# EAGLE design untitled (EAGLE 5.00)
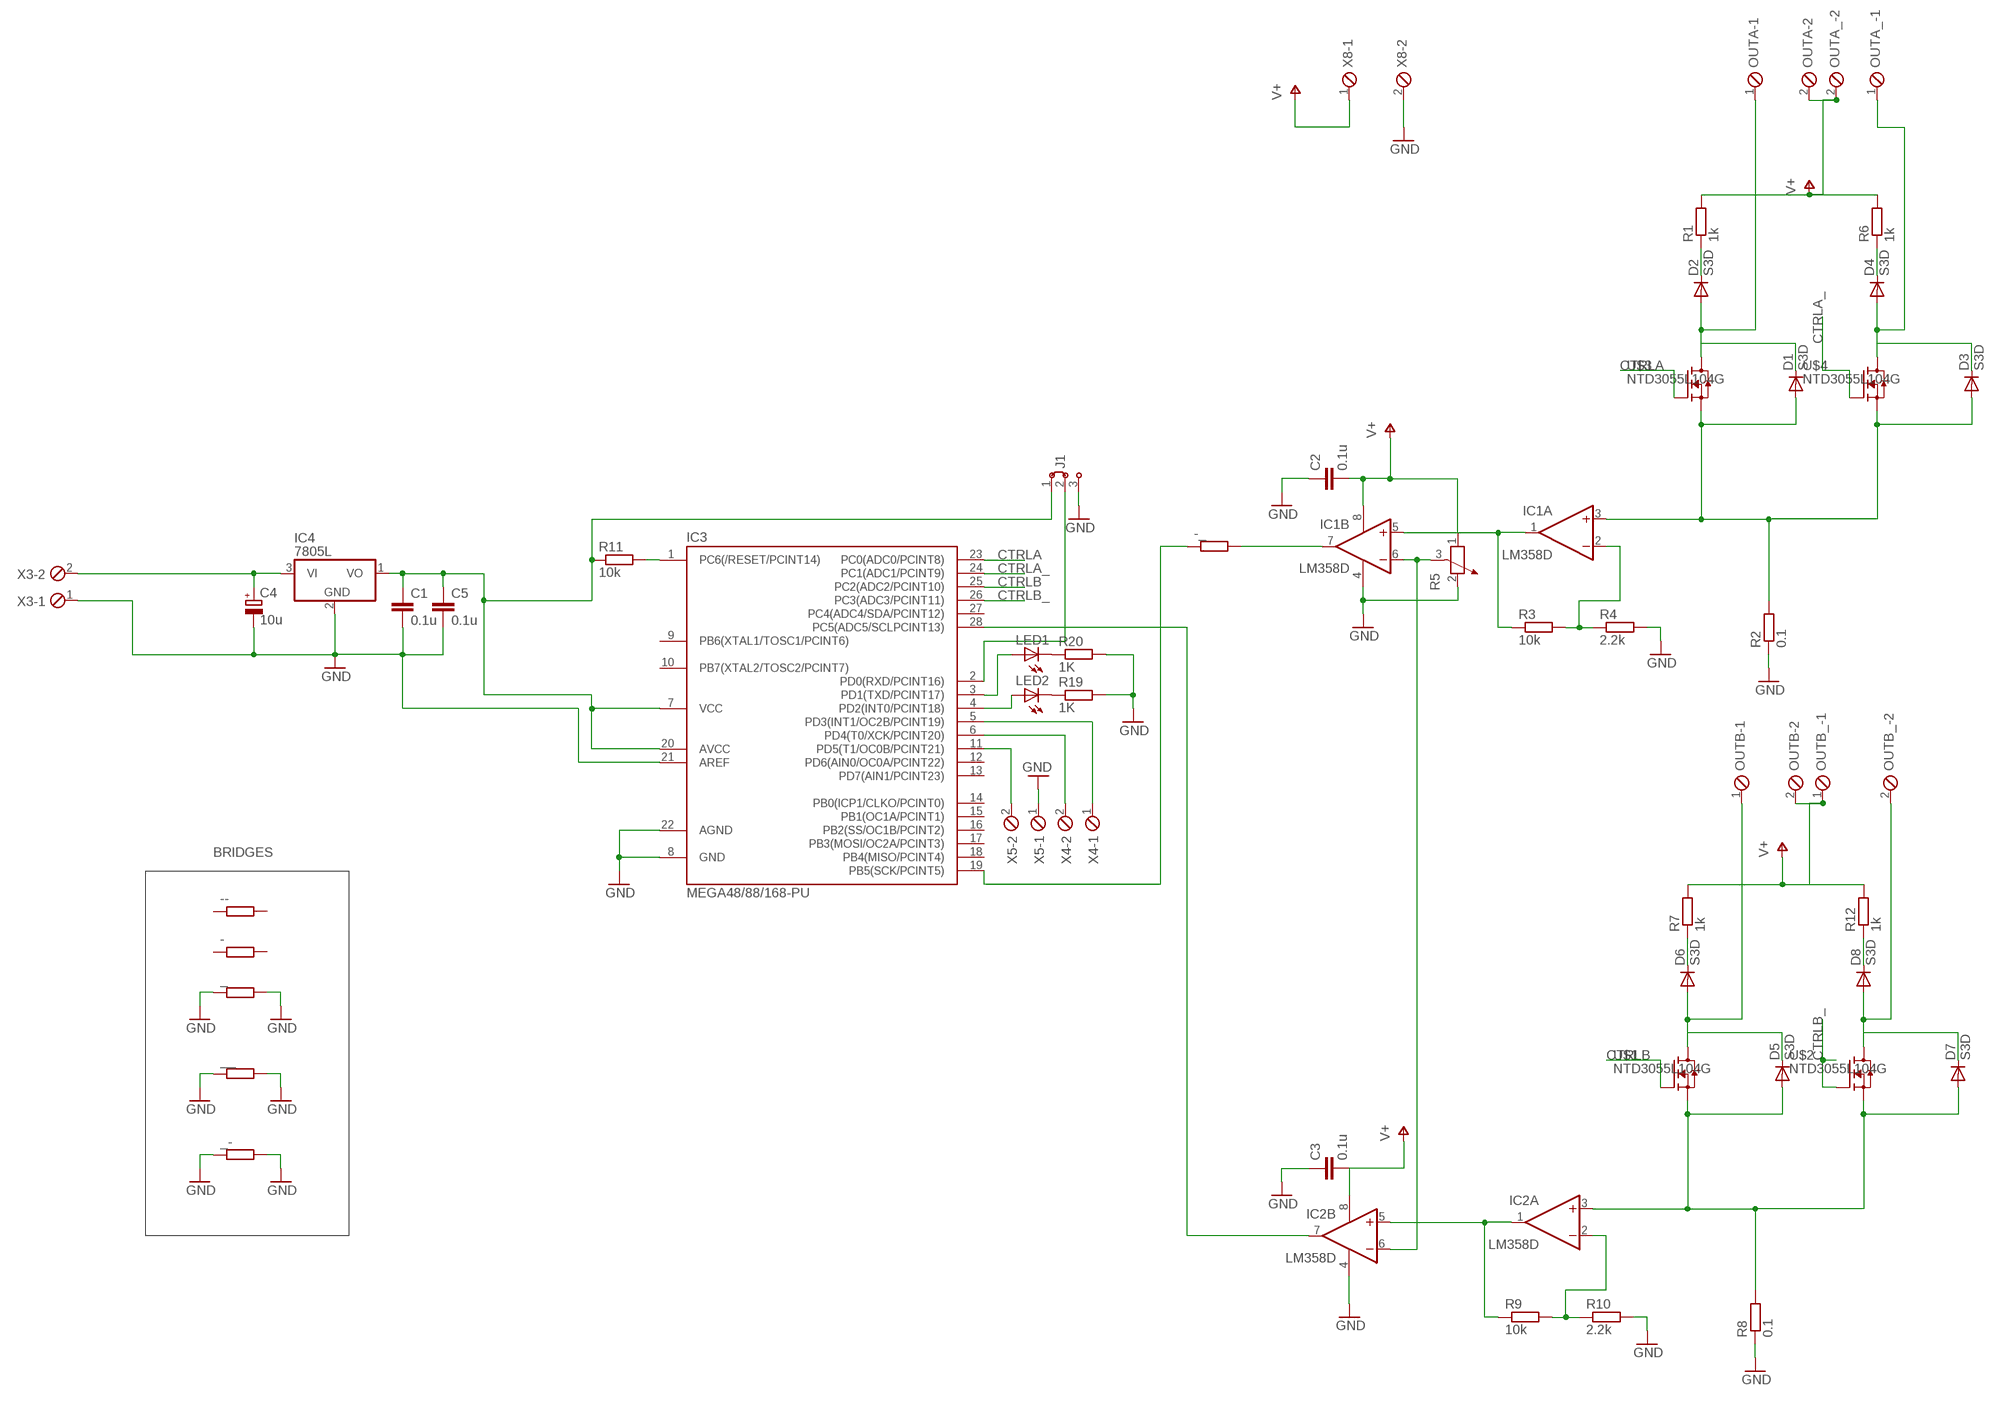
[diagram p0: schematic, sheet 1]

## Parts
-  R-EU_R1206  [R1206]
--  R-EU_R1206  [R1206]
-_  R-EU_R1206  [R1206]
_  R-EU_R1206  [R1206]
_-  R-EU_R1206  [R1206]
__  R-EU_R1206  [R1206]
C1  0.1u  C-EUC1206  [C1206]
C2  0.1u  C-EUC1206  [C1206]
C3  0.1u  C-EUC1206  [C1206]
C4  10u  CPOL-EUE3.5-8  [E3,5-8]
C5  0.1u  C-EUC1206  [C1206]
D1  S3D  DIODE-SMC  [SMC]
D2  S3D  DIODE-SMC  [SMC]
D3  S3D  DIODE-SMC  [SMC]
D4  S3D  DIODE-SMC  [SMC]
D5  S3D  DIODE-SMC  [SMC]
D6  S3D  DIODE-SMC  [SMC]
D7  S3D  DIODE-SMC  [SMC]
D8  S3D  DIODE-SMC  [SMC]
IC1  LM358D  [SO08]
IC2  LM358D  [SO08]
IC3  MEGA48/88/168-PU  [DIL28-3]
IC4  7805L  [TO92]
J1  J2X2MM  [04C]
LED1  LED5MM  [LED5MM]
LED2  LED5MM  [LED5MM]
OUTA  MPT2  [2POL254]
OUTA_  MPT2  [2POL254]
OUTB  MPT2  [2POL254]
OUTB_  MPT2  [2POL254]
R1  1k  R-EU_0207/10  [0207/10]
R2  0.1  R-EU_0617/22  [0617/22]
R3  10k  R-EU_R0805  [R0805]
R4  2.2k  R-EU_R0805  [R0805]
R5  POTENTIOMETER_PT-10  [PT-10]
R6  1k  R-EU_0207/10  [0207/10]
R7  1k  R-EU_0207/10  [0207/10]
R8  0.1  R-EU_0617/22  [0617/22]
R9  10k  R-EU_R0805  [R0805]
R10  2.2k  R-EU_R0805  [R0805]
R11  10k  R-EU_R0805  [R0805]
R12  1k  R-EU_0207/10  [0207/10]
R19  1K  R-EU_R0805  [R0805]
R20  1K  R-EU_R0805  [R0805]
U$1  NTD3055L104G  [TO252]
U$2  NTD3055L104G  [TO252]
U$3  NTD3055L104G  [TO252]
U$4  NTD3055L104G  [TO252]
X3  MPT2  [2POL254]
X4  MPT2  [2POL254]
X5  MPT2  [2POL254]
X8  MPT2  [2POL254]

## Nets
CTRLA: IC3.23(PC0(ADC0/PCINT8)) U$3.1(G)
CTRLA_: IC3.24(PC1(ADC1/PCINT9)) U$4.1(G)
CTRLB: IC3.25(PC2(ADC2/PCINT10)) U$1.1(G)
CTRLB_: IC3.26(PC3(ADC3/PCINT11)) U$2.1(G)
GND: _-.1 _-.2 _.1 _.2 __.1 __.2 C1.2 C2.1 C3.1 C4.- C5.2 IC1.4(P:V-) IC2.4(P:V-) IC3.8(GND) IC3.21(AREF) IC3.22(AGND) IC4.2(GND) J1.3 R2.1 R4.2 R5.2 R8.1 R10.2 R19.2 R20.2 X3.1 X5.1 X8.2
N$1: IC1.1(A:OUT) IC1.5(B:+IN) R3.1
N$2: IC1.2(A:-IN) R3.2 R4.1
N$3: -_.1 IC3.19(PB5(SCK/PCINT5))
N$4: IC2.7(B:OUT) IC3.28(PC5(ADC5/SCLPCINT13))
N$5: IC3.11(PD5(T1/OC0B/PCINT21)) X5.2
N$6: IC1.6(B:-IN) IC2.6(B:-IN) R5.3
N$7: D1.C D2.A OUTA.1 U$3.3(D)
N$8: D2.C R1.1
N$9: C4.+ IC4.3(VI) X3.2
N$10: D3.C D4.A OUTA_.1 U$4.3(D)
N$11: D4.C R6.1
N$12: D1.A D3.A IC1.3(A:+IN) R2.2 U$3.2(S) U$4.2(S)
N$13: -_.2 IC1.7(B:OUT)
N$14: IC3.1(PC6(/RESET/PCINT14)) R11.2
N$15: IC3.6(PD4(T0/XCK/PCINT20)) X4.2
N$16: IC2.1(A:OUT) IC2.5(B:+IN) R9.1
N$17: IC2.2(A:-IN) R9.2 R10.1
N$18: LED2.K(C) R19.1
N$19: C1.1 C5.1 IC3.7(VCC) IC3.20(AVCC) IC4.1(VO) J1.1 R11.1
N$20: D5.C D6.A OUTB.1 U$1.3(D)
N$21: D6.C R7.1
N$22: D7.C D8.A OUTB_.2 U$2.3(D)
N$23: D8.C R12.1
N$24: D5.A D7.A IC2.3(A:+IN) R8.2 U$1.2(S) U$2.2(S)
N$25: LED1.K(C) R20.1
N$26: IC3.5(PD3(INT1/OC2B/PCINT19)) X4.1
N$27: IC3.4(PD2(INT0/PCINT18)) LED2.A
N$28: IC3.3(PD1(TXD/PCINT17)) LED1.A
N$29: IC3.2(PD0(RXD/PCINT16)) J1.2
V+: C2.2 C3.2 IC1.8(P:V+) IC2.8(P:V+) OUTA.2 OUTA_.2 OUTB.2 OUTB_.1 R1.2 R5.1 R6.2 R7.2 R12.2 X8.1
Unconnected: --.1 --.2 -.1 -.2 IC3.9(PB6(XTAL1/TOSC1/PCINT6)) IC3.10(PB7(XTAL2/TOSC2/PCINT7)) IC3.12(PD6(AIN0/OC0A/PCINT22)) IC3.13(PD7(AIN1/PCINT23)) IC3.14(PB0(ICP1/CLKO/PCINT0)) IC3.15(PB1(OC1A/PCINT1)) IC3.16(PB2(SS/OC1B/PCINT2)) IC3.17(PB3(MOSI/OC2A/PCINT3)) IC3.18(PB4(MISO/PCINT4)) IC3.27(PC4(ADC4/SDA/PCINT12))

## Notes on the sheet
- BRIDGES

## Library data of the parts
- -- -_ _ _- __ R3 R4 R9-R11 R19 R20 = rcl:R-EU_: RESISTOR, European symbol
C1-C3 C5 = rcl:C-EU: CAPACITOR, European symbol
C4 = rcl:CPOL-EU: POLARIZED CAPACITOR, European symbol
D1-D8 = diode:DIODE-: DIODE
IC1 IC2 = linear:LM358: OP AMP also LM158; LM258; LM2904 Source: http://cache.national.com/ds/LM/LM158.pdf
IC3 = avr-4:MEGA48/88/168-PU
IC4 = linear:78*: Positive VOLTAGE REGULATOR Source: http://cache.national.com/ds/LM/LM78L05.pdf http://www.fairchildsemi.com/ds/LM/LM7805.pdf
J1 = jumper:J2: Jumper switch 2 x 2.5 mm
LED1 LED2 = led:LED: LED OSRAM: - CHIPLED LG R971, LG N971, LY N971, LG Q971, LY Q971, LO R971, LY R971 LH N974, LH R974 LS Q976, LO Q976, LY Q976 LO Q996 - Hyper CHIPLED LW Q18S LB Q993, LB Q99A, LB R99A - SideLED LS A670, LO A670, LY A670, LG A670, LP A670 LB A673, LV A673, LT A673, LW A673 LH A674 LY A675 LS A676, LA A676, LO A676, LY A676, LW A676 LS A679, LY A679, LG A679 - Hyper Micro SIDELED® LS Y876, LA Y876, LO Y876, LY Y876 LT Y87S - SmartLED LW L88C, LW L88S LB L89C, LB L89S, LG L890 LS L89K, LO L89K, LY L89K LS L896, LA L896, LO L896, LY L896 - TOPLED LS T670, LO T670, LY T670, LG T670, LP T670 LSG T670, LSP T670, LSY T670, LOP T670, LYG T670 LG T671, LOG T671, LSG T671 LB T673, LV T673, LT T673, LW T673 LH T674 LS T676, LA T676, LO T676, LY T676, LB T676, LH T676, LSB T676, LW T676 LB T67C, LV T67C, LT T67C, LS T67K, LO T67K, LY T67K, LW E67C LS E67B, LA E67B, LO E67B, LY E67B, LB E67C, LV E67C, LT E67C LW T67C LS T679, LY T679, LG T679 LS T770, LO T770, LY T770, LG T770, LP T770 LB T773, LV T773, LT T773, LW T773 LH T774 LS E675, LA E675, LY E675, LS T675 LS T776, LA T776, LO T776, LY T776, LB T776 LHGB T686 LT T68C, LB T68C - Hyper Mini TOPLED® LB M676 - Mini TOPLED Santana® LG M470 LS M47K, LO M47K, LY M47K Source: http://www.osram.convergy.de - LUMILED® LXK2-PW12-R00, LXK2-PW12-S00, LXK2-PW14-U00, LXK2-PW14-V00 LXK2-PM12-R00, LXK2-PM12-S00, LXK2-PM14-U00 LXK2-PE12-Q00, LXK2-PE12-R00, LXK2-PE12-S00, LXK2-PE14-T00, LXK2-PE14-U00 LXK2-PB12-K00, LXK2-PB12-L00, LXK2-PB12-M00, LXK2-PB14-N00, LXK2-PB14-P00, LXK2-PB14-Q00 LXK2-PR12-L00, LXK2-PR12-M00, LXK2-PR14-Q00, LXK2-PR14-R00 LXK2-PD12-Q00, LXK2-PD12-R00, LXK2-PD12-S00 LXK2-PH12-R00, LXK2-PH12-S00 LXK2-PL12-P00, LXK2-PL12-Q00, LXK2-PL12-R00 Source: www.luxeon.com
OUTA OUTA_ OUTB OUTB_ X3-X5 X8 = con-phoenix-254:MPT2: PHOENIX CONNECTOR
R1 R2 R6-R8 R12 = resistor:R-EU_: RESISTOR, European symbol
R5 = rcl:POTENTIOMETER_: Potentiometer
U$1-U$4 = transistor-fet:NTD3055L104G

## Board
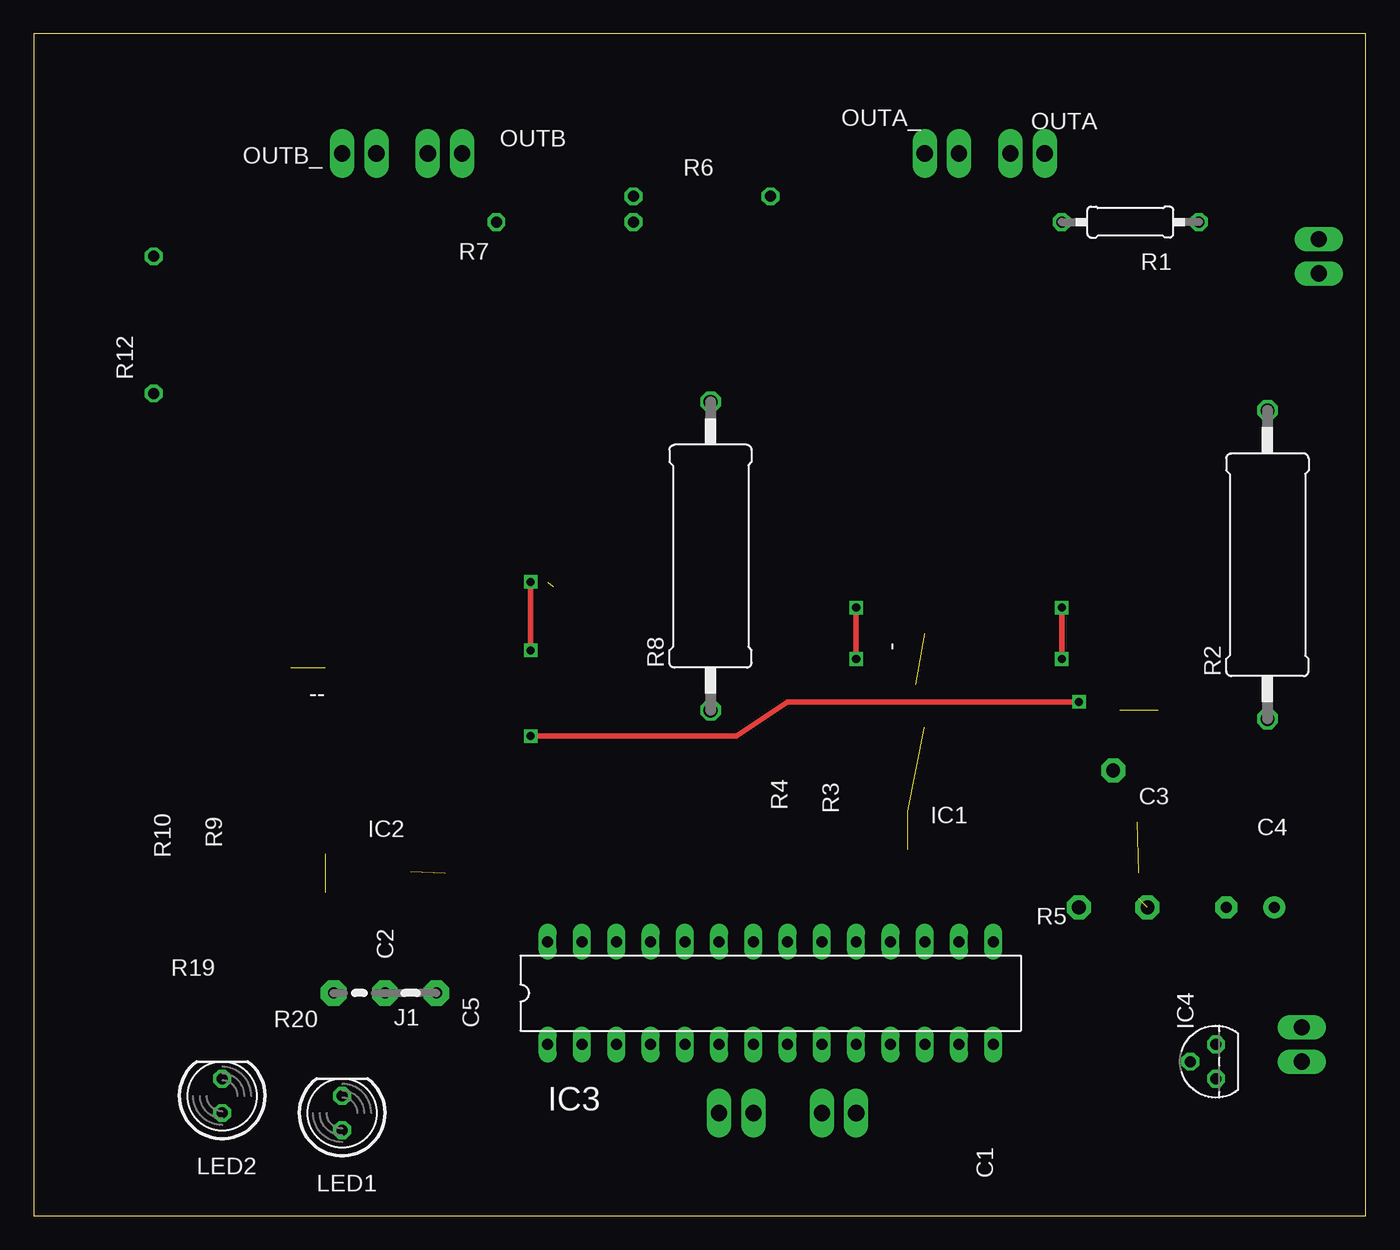
[diagram p1: board, top side]
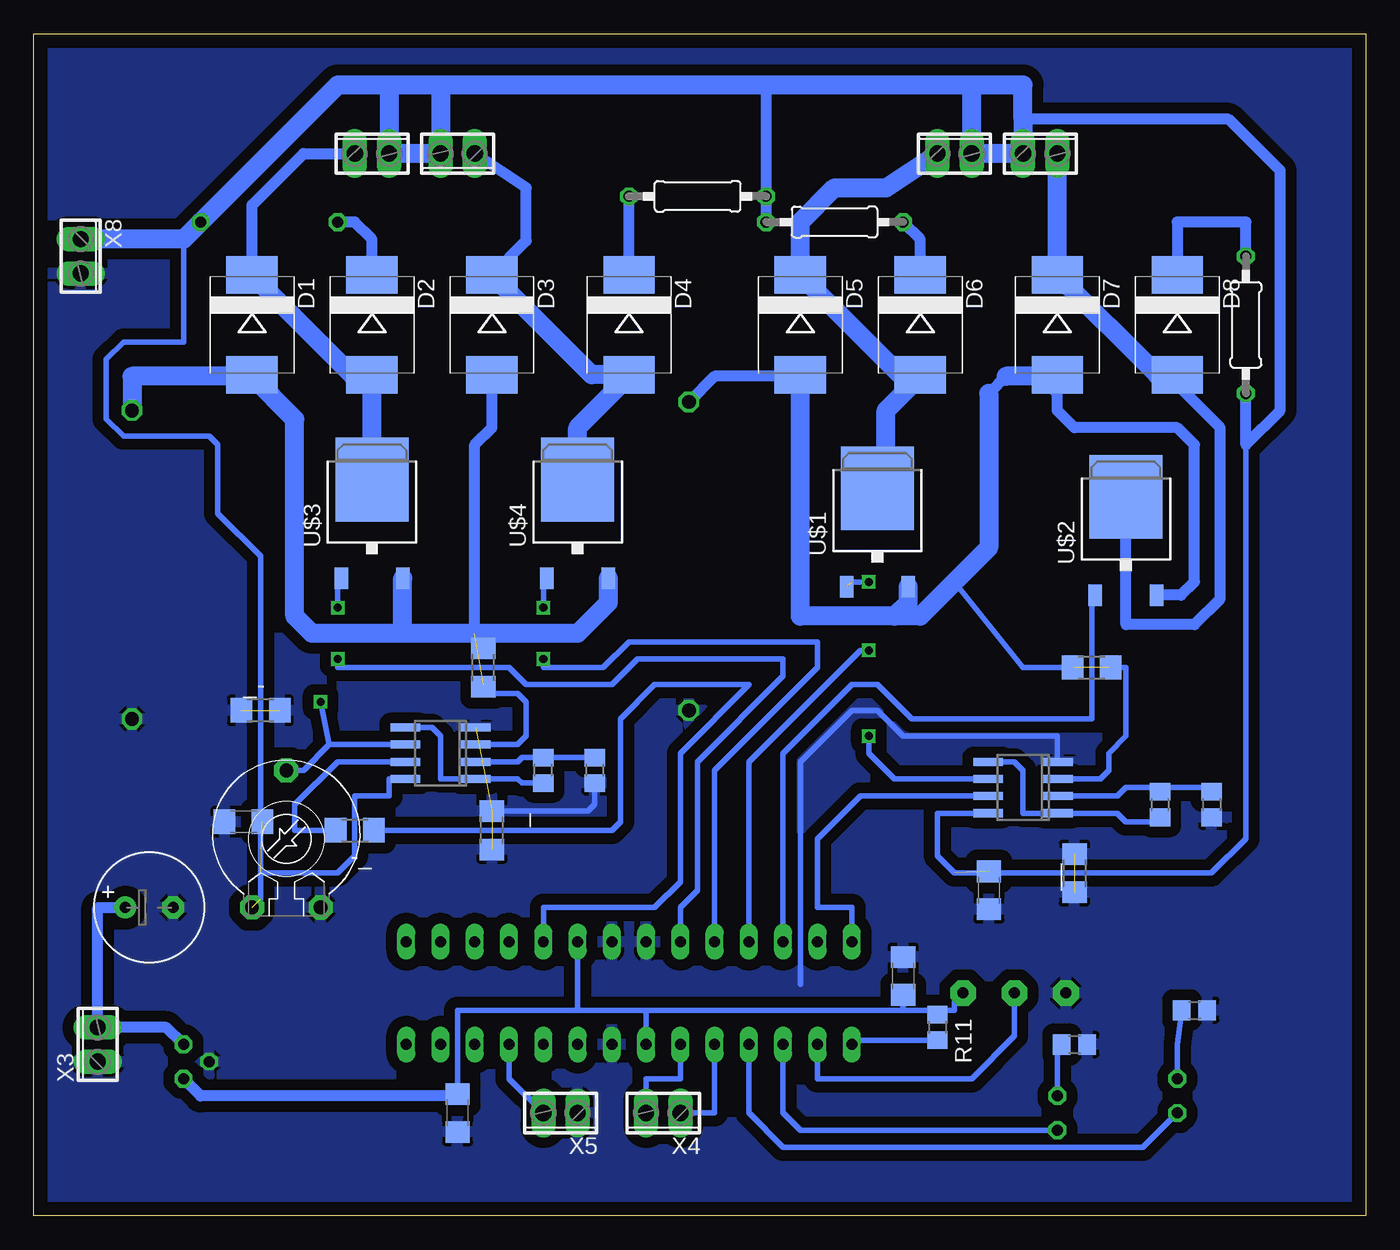
[diagram p2: board, bottom side, seen from below]

Size 98.73 x 87.62 mm. Coordinates in mm from the lower left corner, seen from the top.
Outline: 0,0 98.73,0 98.73,87.62 0,87.62 0,0
Copper layers (1*16): Top 0.035mm / dielectric 1.5mm / Bottom 0.035mm
Design rules "default": minimum track width 10mil, minimum drill 24mil, track to track 8mil, track to pad 8mil, pad to pad 8mil, via to via 8mil, smd to smd 8mil, copper to edge 40mil, drill to drill 8mil, minimum pad ring 10mil, minimum via ring 8mil, stop-mask expansion 4mil, vias tented up to drill 0mil, thermal gap 10mil

### Footprints (pad centres in the part's own frame; a part is rotated, then mirrored left to right if it is on the bottom)
R1206 = smd 1.6 x 1.803: 1 -1.422,0; 2 1.422,0
C1206 = smd 1.6 x 1.8: 1 -1.4,0; 2 1.4,0
E3,5-8 = drill 0.813 pad 1.6: + -1.778,0 | drill 0.813 pad 1.6 octagon: - 1.778,0
SMC = smd 2.8 x 3.8: A 3.7,0; C -3.7,0
SO08 = smd 0.6 x 2.2: 1 -1.905,-2.6; 2 -0.635,-2.6; 3 0.635,-2.6; 4 1.905,-2.6; 5 1.905,2.6; 6 0.635,2.6; 7 -0.635,2.6; 8 -1.905,2.6
DIL28-3 = drill 0.813 long: 1 -16.51,-3.81; 2 -13.97,-3.81; 3 -11.43,-3.81; 4 -8.89,-3.81; 5 -6.35,-3.81; 6 -3.81,-3.81; 7 -1.27,-3.81; 8 1.27,-3.81; 9 3.81,-3.81; 10 6.35,-3.81; 11 8.89,-3.81; 12 11.43,-3.81; 13 13.97,-3.81; 14 16.51,-3.81; 15 16.51,3.81; 16 13.97,3.81; 17 11.43,3.81; 18 8.89,3.81; 19 6.35,3.81; 20 3.81,3.81; 21 1.27,3.81; 22 -1.27,3.81; 23 -3.81,3.81; 24 -6.35,3.81; 25 -8.89,3.81; 26 -11.43,3.81; 27 -13.97,3.81; 28 -16.51,3.81
TO92 = drill 0.813 octagon: 1 -1.27,0; 2 0,1.905; 3 1.27,0
04C = drill 0.813 pad 1.905 octagon: 1 -1.905,0; 2 1.905,0; 3 5.715,0
LED5MM = drill 0.813 octagon: A -1.27,0; K 1.27,0
2POL254 = drill 1.2 long: 1 -1.27,0; 2 1.27,0
0207/10 = drill 0.813 octagon: 1 -5.08,0; 2 5.08,0
0617/22 = drill 1.016 octagon: 1 -11.43,0; 2 11.43,0
R0805 = smd 1.3 x 1.5: 1 -0.95,0; 2 0.95,0
PT-10 = drill 1.016 pad 1.778 octagon: 1 -2.54,-5.08; 2 2.54,-5.08; 3 0,5.08
TO252 = smd 1 x 1.6: 1 -2.28,-4.8; 2 2.28,-4.8 | smd 5.4 x 6.2: 3 0,2.5

### Placement (x,y rotation side)
-  65.41,40.64 270 bottom
--  20.32,40.64 180 bottom
-_  74.93,28.58 180 bottom
_  64.77,28.58 270 bottom
_-  81.92,37.46 0 bottom
__  21.59,25.4 90 bottom
C1  67.31,7.62 270 bottom
C2  27.94,24.13 90 bottom
C3  83.19,29.21 0 bottom
C4  90.17,22.86 0 bottom
C5  34.29,17.78 90 bottom
D1  82.55,66.04 270 bottom
D2  73.66,66.04 270 bottom
D3  64.77,66.04 270 bottom
D4  54.61,66.04 270 bottom
D5  41.91,66.04 270 bottom
D6  33.02,66.04 270 bottom
D7  22.86,66.04 270 bottom
D8  13.97,66.04 270 bottom
IC1  68.58,34.29 90 bottom
IC2  25.4,31.75 90 bottom
IC3  54.61,16.51 0 top
IC4  87.63,11.43 90 top
J1  27.94,16.51 180 top
LED1  22.86,7.62 90 top
LED2  13.97,8.89 90 top
OUTA  73.66,78.74 0 bottom
OUTA_  67.31,78.74 180 bottom
OUTB  30.48,78.74 0 bottom
OUTB_  24.13,78.74 0 bottom
R1  81.28,73.66 0 top
R2  91.44,48.26 90 top
R3  60.96,33.02 90 bottom
R4  57.15,33.02 270 bottom
R5  80.01,27.94 0 bottom
R6  49.53,75.56 0 bottom
R7  39.37,73.66 180 bottom
R8  50.16,48.89 90 top
R9  15.24,30.48 90 bottom
R10  11.43,30.48 270 bottom
R11  31.75,13.97 270 bottom
R12  8.89,66.04 270 bottom
R19  12.7,15.24 0 bottom
R20  21.59,12.7 0 bottom
U$1  36.2,51.43 0 bottom
U$2  17.78,50.8 0 bottom
U$3  73.66,52.07 0 bottom
U$4  58.42,52.07 0 bottom
X3  93.98,12.7 90 bottom
X4  52.07,7.62 180 bottom
X5  59.69,7.62 180 bottom
X8  95.25,71.12 270 bottom

### Tracks (layer width: path | path; a pad name or v marks a point on that pad's centre or on a via)
CTRLA  (via drill 0.6)
  Top 0.406: v76.2,41.27 v76.2,45.09
  Bottom 0.406: IC3.23 50.8,22.86 49.53,24.13 49.53,33.66 43.18,40 43.18,41.27 53.98,41.27 55.88,39.37 62.23,39.37 63.5,40.64 76.2,40.64 v76.2,41.27 | U$3.1 75.94,47.25 76.2,46.99 v76.2,45.09
CTRLA_  (via drill 0.6)
  Top 0.406: v60.96,41.27 v60.96,45.09
  Bottom 0.406: IC3.24 48.26,33.02 40.64,40.64 40.64,42.55 54.61,42.55 56.52,40.64 60.96,40.64 v60.96,41.27 | U$4.1 60.96,47.01 v60.96,45.09
CTRLB  (via drill 0.6)  (1 unrouted)
  Top 0.406: v36.83,41.91 v36.83,46.99
  Bottom 0.406: IC3.25 45.72,33.66 37.47,41.91 v36.83,41.91 | v36.83,46.99 38.1,46.99
CTRLB_
  Bottom 0.406: IC3.26 43.18,34.29 38.1,39.37 36.2,39.37 33.66,36.83 20.32,36.83 20.32,45.72 20.06,45.98 U$2.1
GND  (4 unrouted)
  Bottom 0.406: IC2.4 22.86,33.72 22.86,35.56 34.29,35.56 36.2,37.46 38.1,37.46 41.91,33.66 41.91,17.14 | _.1 57.63,30 57.15,30.48 R4.2
  pour Bottom (isolate 0.813): 0,86.36 97.79,86.36 97.79,-6.35 0,-6.35
N$1
  Bottom 0.406: R3.1 62.55,32.07 62.87,32.38 IC1.1 68.58,32.38 68.58,35.56 69.22,36.2 IC1.5
N$2
  Bottom 0.406: IC1.2 62.87,33.66 62.55,33.97 R3.2 R4.1
N$3
  Bottom 0.406: 52.7,39.37 46.99,39.37 | 52.7,39.37 55.24,36.83 55.24,29.21 55.88,28.58 -_.1 73.66,28.58 | 52.7,39.37 45.72,39.37 50.8,34.29 50.8,24.77 52.7,22.86 60.96,22.86 IC3.19
N$4
  Bottom 0.406: IC2.7 37.47,31.12 40.64,27.94 40.64,22.86 38.1,22.86 IC3.28
N$5
  Bottom 0.406: X5.2 63.5,10.16 IC3.11
N$6  (via drill 0.6)
  Top 0.406: v36.83,35.56 52.07,35.56 55.88,38.1 v77.47,38.1
  Bottom 0.406: IC1.6 76.83,34.92 | 76.83,34.92 78.74,33.02 R5.3 | IC2.6 34.92,32.38 36.83,34.29 v36.83,35.56 | v77.47,38.1 76.83,34.92
N$7
  Bottom 0.813: D2.A 75.15,62.34 | D1.C 82.55,74.93 78.74,78.74 OUTA.1
  Bottom 1.422: 75.15,62.34 D1.C | U$3.3 D2.A
N$8
  Bottom 0.813: D2.C 73.66,72.39 74.93,73.66 R1.1
N$9
  Bottom 0.813: C4.+ 93.98,22.86 X3.2 88.9,13.97 IC4.3
N$10
  Bottom 0.813: D3.C 62.23,72.28 62.23,76.2 OUTA_.1
  Bottom 1.422: D3.C 57.37,62.34 D4.A 54.61,62.23 58.42,58.42 U$4.3
N$11
  Bottom 0.813: D4.C R6.1
N$12  (1 unrouted)
  Bottom 0.406: IC1.3 62.87,34.92 62.23,35.56 62.23,38.1 62.87,38.73 64.77,38.73 65.41,39.37
  Bottom 0.813: D3.A 64.77,58.42 66.04,57.15 66.04,43.18
  Bottom 1.422: R2.2 91.44,62.23 82.55,62.23 | U$4.2 56.14,45.46 58.42,43.18 66.04,43.18 71.12,43.18 | 82.55,62.23 D1.A | 82.55,62.23 79.38,59.05 79.38,44.45 78.11,43.18 71.12,43.18 | U$3.2 71.38,43.44 71.12,43.18
N$13
  Bottom 0.406: IC1.7 76.2,33.66 79.38,30.48 79.38,28.58 -_.2
N$14
  Bottom 0.406: R11.2 37.78,13.02 IC3.1
N$15
  Bottom 0.406: X4.2 53.34,10.16 50.8,10.16 IC3.6
N$16
  Bottom 0.406: R9.1 15.56,29.21 17.78,29.21 18.41,29.84 IC2.1 25.4,29.84 25.4,33.02 26.04,33.66 IC2.5
N$17
  Bottom 0.406: IC2.2 18.41,31.12 17.78,31.75 15.56,31.75 R9.2 15.24,31.75 11.75,31.75 R10.1
N$18
  Bottom 0.406: R19.1 13.97,12.7 LED2.K
N$19
  Bottom 0.406: C1.1 67.31,15.24 58.42,15.24 | 53.34,15.24 IC3.7 | 31.75,15.24 30.48,15.24 30.48,15.88 J1.1 | 31.75,15.24 34.29,15.24 | 34.29,15.24 53.34,15.24 | 34.29,15.24 C5.1 | R11.1 31.75,15.24 | 53.34,15.24 58.42,15.24 | 58.42,15.24 IC3.20
  Bottom 0.813: C1.1 67.31,8.89 86.36,8.89 IC4.1
N$20
  Bottom 0.813: 33.02,62.23 31.75,62.23 | D6.A 34.51,62.34
  Bottom 1.422: 34.51,62.34 D5.C 41.91,73.66 39.37,76.2 35.56,76.2 OUTB.1 | U$1.3 35.56,53.93 35.56,59.69 33.02,62.23 D6.A
N$21
  Bottom 0.813: D6.C 33.02,72.39 R7.1
N$22
  Bottom 0.813: 13.97,61.59 12.7,62.23 | 15.46,62.34 D8.A 13.97,61.59 | U$2.3 17.78,43.81 12.7,43.81 10.79,45.72 10.79,58.42 13.97,61.59
  Bottom 1.422: 15.46,62.34 D7.C OUTB_.2
N$23
  Bottom 0.813: D8.C 13.97,73.66 8.89,73.66 R12.1
N$24  (1 unrouted)
  Bottom 0.406: IC2.3 19.68,32.38 19.05,33.02 19.05,34.29 17.78,35.56 17.78,40.64 19.05,40.64 | 30.48,46.99 25.4,40.64 21.59,40.64
  Bottom 0.813: R8.2 48.26,62.23 41.91,62.23 | 41.91,62.23 D5.A | U$2.2 13.69,46 12.7,46.99 12.7,57.15 13.97,58.42 21.59,58.42 22.86,59.69 22.86,60.96 | 22.86,60.96 D7.A | 22.86,60.96 24.13,62.23 | 26.67,62.23 27.94,60.96 | 41.91,60.96 41.91,62.23
  Bottom 1.422: 24.13,62.23 26.67,62.23 | 27.94,60.96 27.94,49.53 30.48,46.99 33.02,44.45 34.92,44.45 | 34.92,44.45 33.91,45.46 U$1.2 | 41.91,60.96 41.91,44.45 34.92,44.45
N$25
  Bottom 0.406: R20.1 22.86,12.7 LED1.K
N$26
  Bottom 0.406: X4.1 48.26,7.62 IC3.5
N$27
  Bottom 0.406: IC3.4 45.72,7.62 43.18,5.08 16.51,5.08 LED2.A
N$28
  Bottom 0.406: IC3.3 43.18,7.62 41.91,6.35 LED1.A
N$29
  Bottom 0.406: J1.2 26.04,13.34 29.21,10.16 40.64,10.16 IC3.2
V+  (3 unrouted)
  Bottom 0.406: 8.89,57.15 8.89,27.94 11.43,25.4 30.48,25.4 31.75,26.67 31.75,29.84 IC2.8 | 81.92,25.4 81.92,48.89 85.09,52.07 85.09,57.15 85.72,57.78 92.08,57.78 93.34,59.05 93.34,63.5 92.08,64.77 87.63,64.77 87.63,72.39 | 81.92,25.4 76.2,25.4 74.93,26.67 74.93,31.12 72.39,31.12 72.39,32.38 IC1.8 71.12,32.38 | 81.92,25.4 81.92,23.49
  Bottom 0.813: R7.2 R6.2 44.45,83.82 | 25.4,81.28 10.16,81.28 6.35,77.47 6.35,59.69 8.89,57.15 R12.2
  Bottom 1.422: X8.1 87.63,72.39 R1.2 76.2,83.82 72.39,83.82 | 68.58,83.82 72.39,83.82 | 68.58,83.82 44.45,83.82 29.21,83.82 | 29.21,83.82 25.4,83.82 25.4,81.28 OUTB_.1 OUTB.2 29.21,83.82 | 72.39,83.82 OUTA.2 OUTA_.2 68.58,83.82